# EAGLE design schematic (EAGLE 9.6.2)
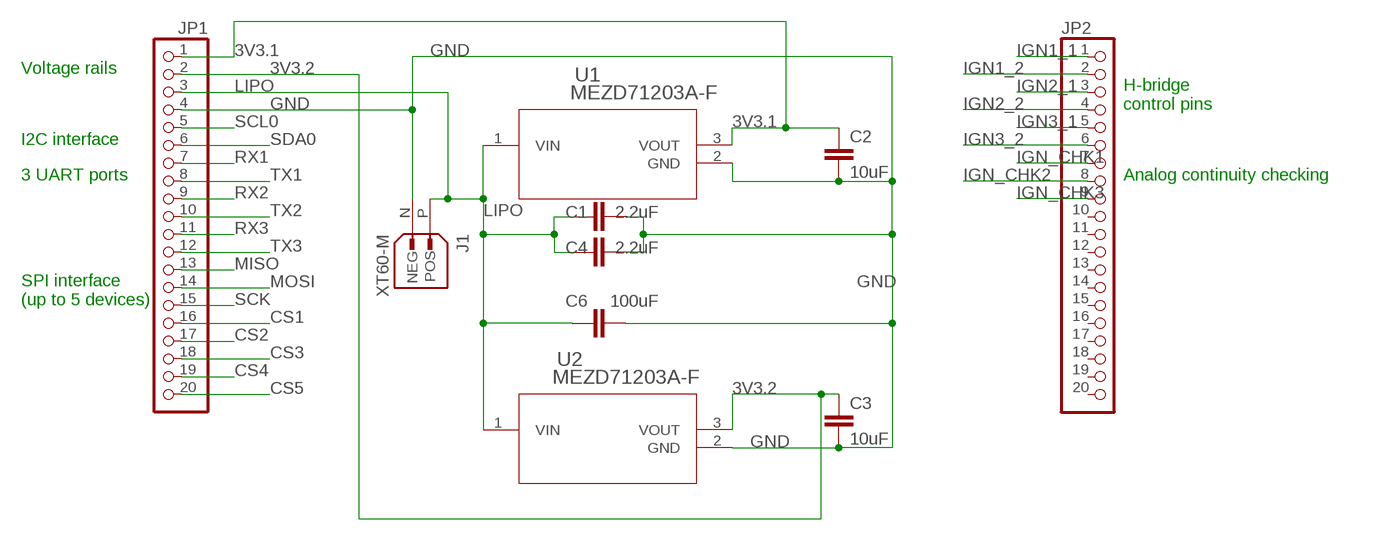
[diagram p0: schematic, sheet 1]

## Parts
C1  2.2uF  C-EUC0805  [C0805]
C2  10uF  C-EUC0805  [C0805]
C3  10uF  C-EUC0805  [C0805]
C4  2.2uF  C-EUC0805  [C0805]
C6  100uF  C-EUC0805  [C0805]
J1  XT60-M  [AMASS_XT60-M]
JP1  PINHD-1X20  [1X20]
JP2  PINHD-1X20  [1X20]
U1  MEZD71203A-F  [MEZD71203A_MNP]
U2  MEZD71203A-F  [MEZD71203A_MNP]

## Nets
3V3.1: C2.1 JP1.1 U1.3(VOUT)
3V3.2: C3.1 JP1.2 U2.3(VOUT)
CS1: JP1.16
CS2: JP1.17
CS3: JP1.18
CS4: JP1.19
CS5: JP1.20
GND: C1.2 C2.2 C3.2 C4.2 C6.2 J1.N(NEG) JP1.4 U1.2(GND) U2.2(GND)
IGN1_1: JP2.1
IGN1_2: JP2.2
IGN2_1: JP2.3
IGN2_2: JP2.4
IGN3_1: JP2.5
IGN3_2: JP2.6
IGN_CHK1: JP2.7
IGN_CHK2: JP2.8
IGN_CHK3: JP2.9
LIPO: C1.1 C4.1 C6.1 J1.P(POS) JP1.3 U1.1(VIN) U2.1(VIN)
MISO: JP1.13
MOSI: JP1.14
RX1: JP1.7
RX2: JP1.9
RX3: JP1.11
SCK: JP1.15
SCL0: JP1.5
SDA0: JP1.6
TX1: JP1.8
TX2: JP1.10
TX3: JP1.12
Unconnected: JP2.10 JP2.11 JP2.12 JP2.13 JP2.14 JP2.15 JP2.16 JP2.17 JP2.18 JP2.19 JP2.20

## Notes on the sheet
- Voltage rails
- H-bridge
  control pins
- I2C interface
- 3 UART ports | Analog continuity checking
- SPI interface
  (up to 5 devices)

## Library data of the parts
C1-C4 C6 = rcl:C-EU: CAPACITOR, European symbol; SPICEPREFIX: C
J1 = XT60-M:XT60-M: Check availability <https://pricing.snapeda.com/parts/XT60-M/AMASS/view-part?ref=eda>; AVAILABILITY: Not in stock; DESCRIPTION: Plug; DC supply; XT60; male; PIN: 2; for cable; soldered; 30A; 500V; MF: AMASS; MP: XT60-M; PACKAGE: Package; PRICE: None
JP1 JP2 = adafruit:PINHD-1X20: PIN HEADER
U1 U2 = My-Library:MEZD71203A-F; COPYRIGHT: Copyright (C) 2022 Ultra Librarian. All rights reserved.; DIGI-KEY_PART_NUMBER_1: 1589-1471-ND; MANUFACTURER_PART_NUMBER: MEZD71203A-F; MFR_NAME: Monolithic Power Systems

## Board
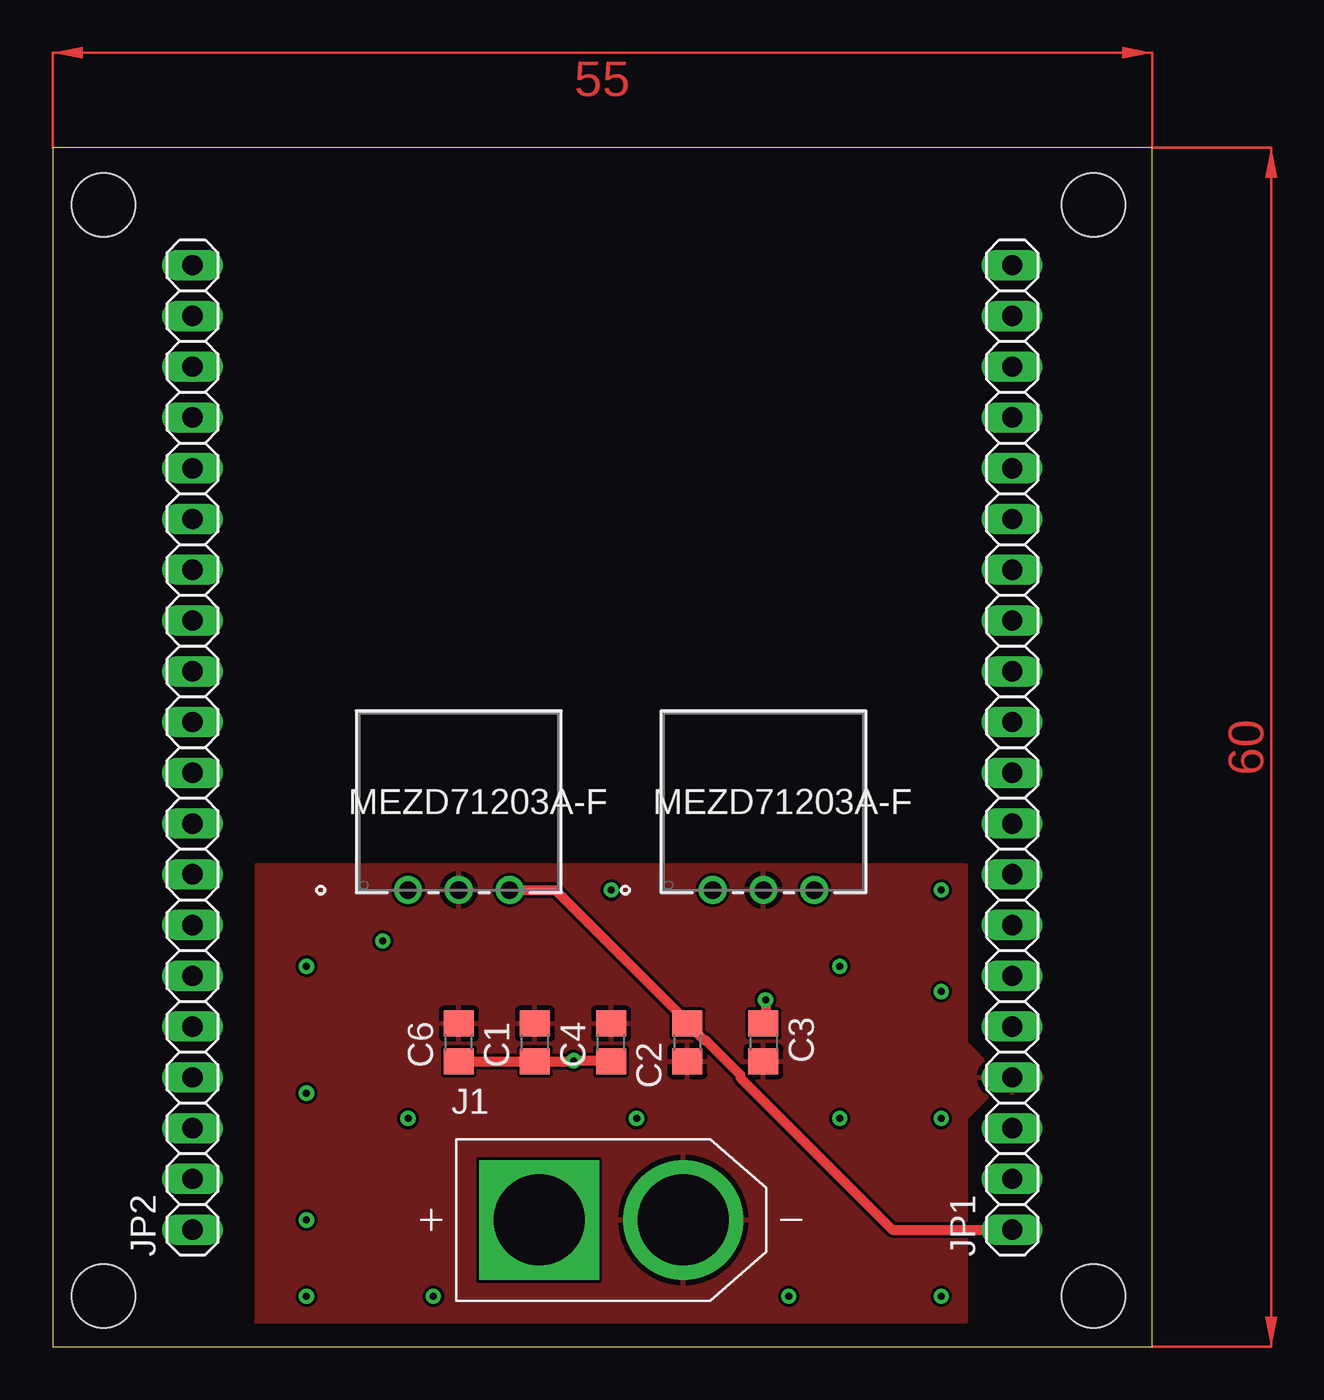
[diagram p1: board, top side]
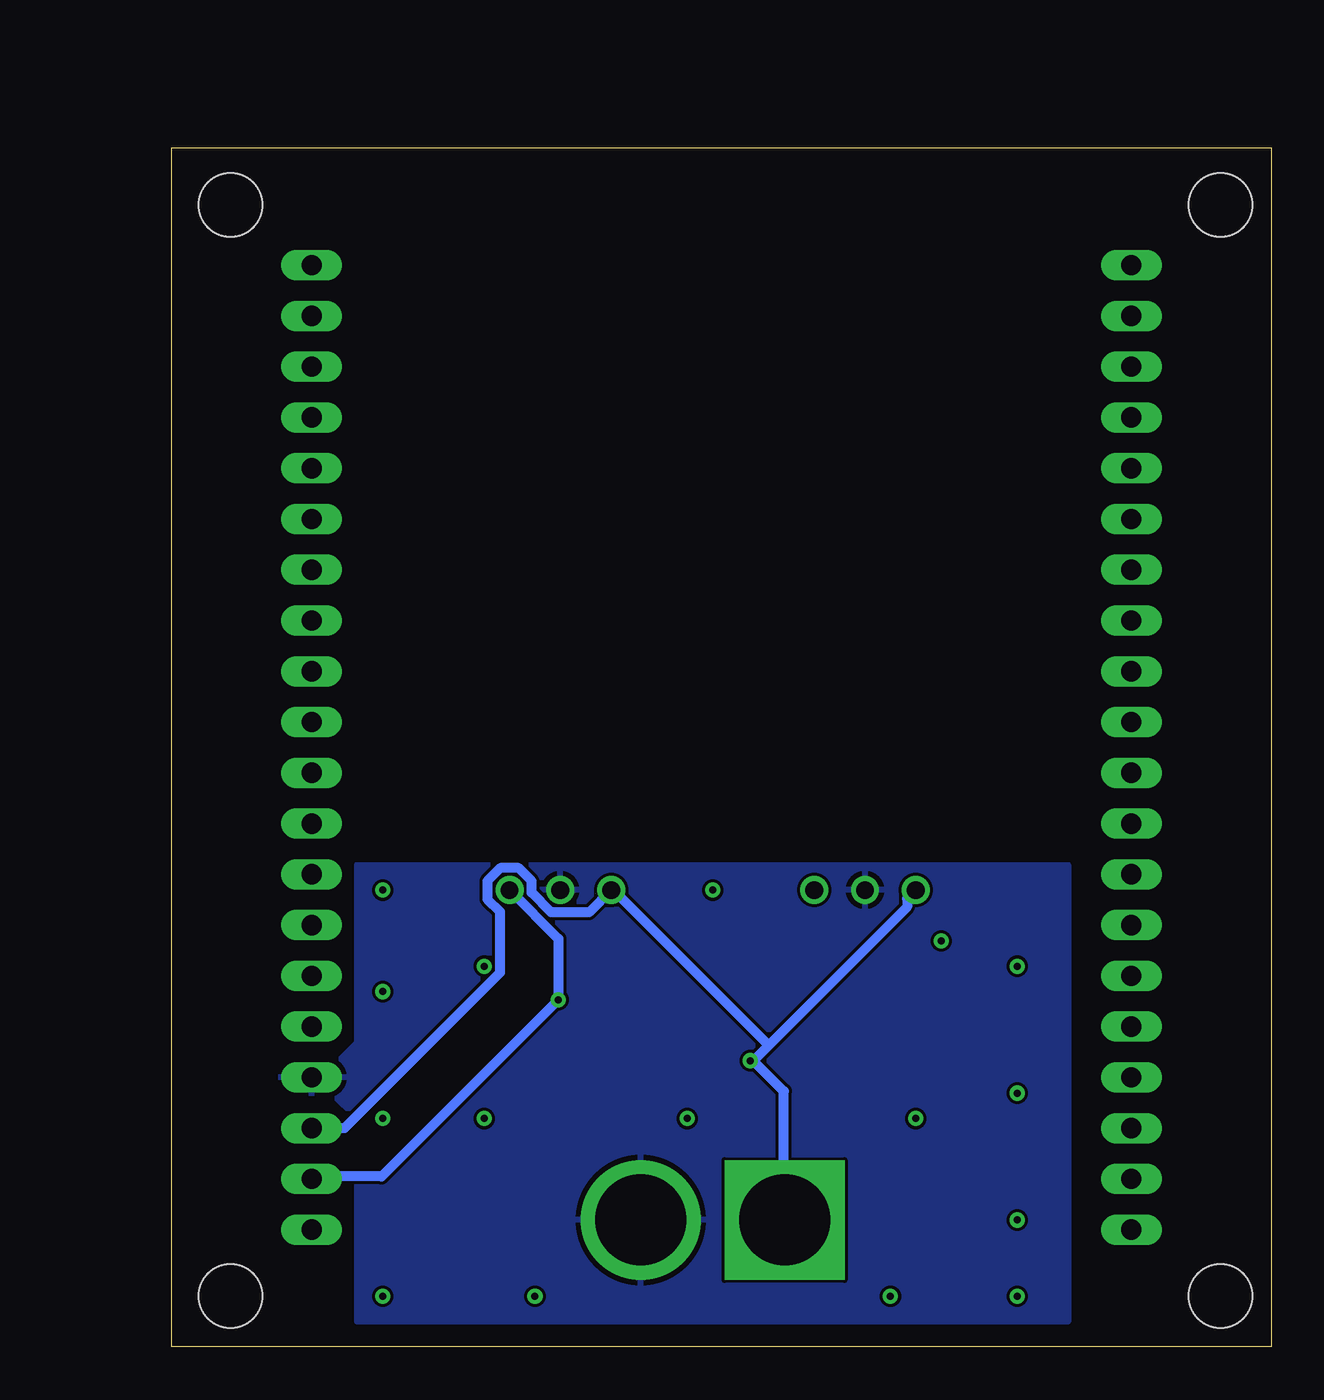
[diagram p2: board, bottom side, seen from below]

Size 55 x 60 mm. Coordinates in mm from the lower left corner, seen from the top.
Outline: 0,0 55,0 55,60 0,60 0,0
Copper layers (1*16): Top 0.035mm / dielectric 1.5mm / Bottom 0.035mm
Design rules "default": minimum track width 6mil, minimum drill 0.35mm, track to track 6mil, track to pad 6mil, pad to pad 6mil, via to via 6mil, smd to smd 6mil, copper to edge 40mil, drill to drill 6mil, minimum pad ring 10mil, minimum via ring 8mil, stop-mask expansion 4mil, vias tented up to drill 0mil, thermal gap 10mil
Holes 3.17 mm at 2.54,2.54 52.07,2.54 52.07,57.15 2.54,57.15

### Footprints (pad centres in the part's own frame; a part is rotated, then mirrored left to right if it is on the bottom)
C0805 = smd 1.3 x 1.5: 1 -0.95,0; 2 0.95,0
AMASS_XT60-M = drill 4.55 pad 6: N 3.6,0 | drill 4.55 pad 6 square: P -3.6,0
1X20 = drill 1.016 long: 1 -24.13,0; 2 -21.59,0; 3 -19.05,0; 4 -16.51,0; 5 -13.97,0; 6 -11.43,0; 7 -8.89,0; 8 -6.35,0; 9 -3.81,0; 10 -1.27,0; 11 1.27,0; 12 3.81,0; 13 6.35,0; 14 8.89,0; 15 11.43,0; 16 13.97,0; 17 16.51,0; 18 19.05,0; 19 21.59,0; 20 24.13,0
MEZD71203A_MNP = drill 0.889 pad 1.397: 1 0,0; 2 2.54,0; 3 5.08,0

### Placement (x,y rotation side)
C1  24.13,15.24 90 top
C2  31.75,15.24 270 top
C3  35.56,15.24 270 top
C4  27.94,15.24 90 top
C6  20.32,15.24 90 top
J1  27.94,6.35 0 top
JP1  48,30 90 top
JP2  7,30 90 top
U1  17.78,22.86 0 top
U2  33.02,22.86 0 top

### Tracks (layer width: path | path; a pad name or v marks a point on that pad's centre or on a via)
3V3.1
  Top 0.152: 31.7,16.31 C2.1
  Top 0.508: U1.3 25.15,22.86 31.7,16.31 | C2.1 32.59,15.35 32.67,15.35 34.4,13.61 34.4,13.47 42.01,5.87 JP1.1
3V3.2  (via drill 0.35)
  Top 0.152: 35.66,16.46 35.66,16.31 C3.1 35.66,16.46
  Top 0.508: v35.66,17.37 35.66,16.46
  Bottom 0.508: U2.3 35.66,20.42 v35.66,17.37 44.5,8.53 47.85,8.53 JP1.2
GND
  pour Bottom: 10.16,1.27 45.72,1.27 45.72,11.43 46.99,12.7 49.53,12.7 49.53,13.97 46.99,13.97 45.72,15.24 45.72,24.13 10.16,24.13
  pour Top: 10.16,24.13 10.16,1.27 45.72,1.27 45.72,11.43 46.99,12.7 49.53,12.7 49.53,13.97 46.99,13.97 45.72,15.24 45.72,24.13
LIPO  (via drill 0.35)
  Top 0.152: 20.42,14.33 20.42,14.29 | 24.08,14.33 C1.1 | 27.89,14.33 C4.1
  Top 0.305: 20.42,14.29 C6.1
  Top 0.508: 27.89,14.33 v26.06,14.33 26.02,14.29 C1.1 C6.1
  Bottom 0.152: 25.91,14.33 v26.06,14.33 | 32.92,22.86 U2.1
  Bottom 0.508: 33.07,22.86 U2.1 34.12,21.75 36.02,21.75 36.99,22.73 36.99,23.32 37.64,23.96 38.56,23.96 39.2,23.32 39.2,22.4 38.59,21.78 38.59,18.73 46.36,10.95 JP1.3 | J1.P 24.38,6.4 24.38,12.8 25.91,14.33 25.15,15.09 | 25.15,15.09 18.21,22.02 18.21,22.43 U1.1 | 25.15,15.09 32.92,22.86
N$1  (via drill 0.35)
  other vias: 12.7,6.35
N$2  (via drill 0.35)
  other vias: 12.7,12.7
N$3  (via drill 0.35)
  other vias: 12.7,19.05
N$4  (via drill 0.35)
  other vias: 12.7,2.54
N$5  (via drill 0.35)
  other vias: 19.05,2.54
N$6  (via drill 0.35)
  other vias: 36.83,2.54
N$7  (via drill 0.35)
  other vias: 44.45,2.54
N$8  (via drill 0.35)
  other vias: 44.45,11.43
N$9  (via drill 0.35)
  other vias: 44.45,17.78
N$10  (via drill 0.35)
  other vias: 44.45,22.86
N$11  (via drill 0.35)
  other vias: 39.37,19.05
N$12  (via drill 0.35)
  other vias: 27.94,22.86
N$13  (via drill 0.35)
  other vias: 39.37,11.43
N$14  (via drill 0.35)
  other vias: 29.21,11.43
N$15  (via drill 0.35)
  other vias: 17.78,11.43
N$16  (via drill 0.35)
  other vias: 16.51,20.32
(copper drawn outside any net)
  shapes: Top area x2